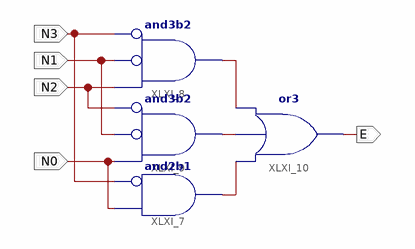
[diagram p0: schematic sheet 1]
// Xilinx ISE schematic comb_e.sch (spartan3e) as structural Verilog: 4 symbols, 5 ports
module comb_e (
  input  N1,
  input  N0,
  input  N3,
  input  N2,
  output E
);

  wire XLXN_17, XLXN_22, XLXN_23;

  and XLXI_7 (XLXN_23, ~N3, N0);  // and2b1
  and XLXI_8 (XLXN_17, ~N3, ~N1, N2);  // and3b2
  and XLXI_9 (XLXN_22, ~N2, ~N1, N0);  // and3b2
  or XLXI_10 (E, XLXN_17, XLXN_22, XLXN_23);
endmodule
